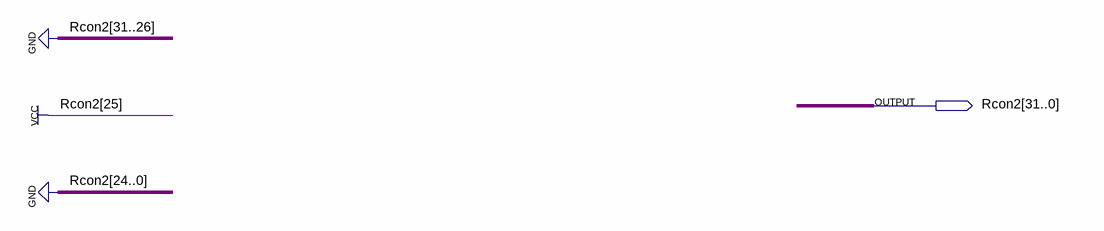
[diagram p0: schematic sheet]
// Quartus schematic Rcon2.bdf as structural Verilog: 0 symbols, 1 pins
module Rcon2 (
  output [31:0] Rcon2
);


  assign Rcon2 = 32'b00000010000000000000000000000000;
endmodule
